# Altium schematic sheet 08-MagnetSensor.SchDoc: Magnet Sensor
size A2; DocumentNumber: 8; SheetNumber: 8; SheetTotal: 15
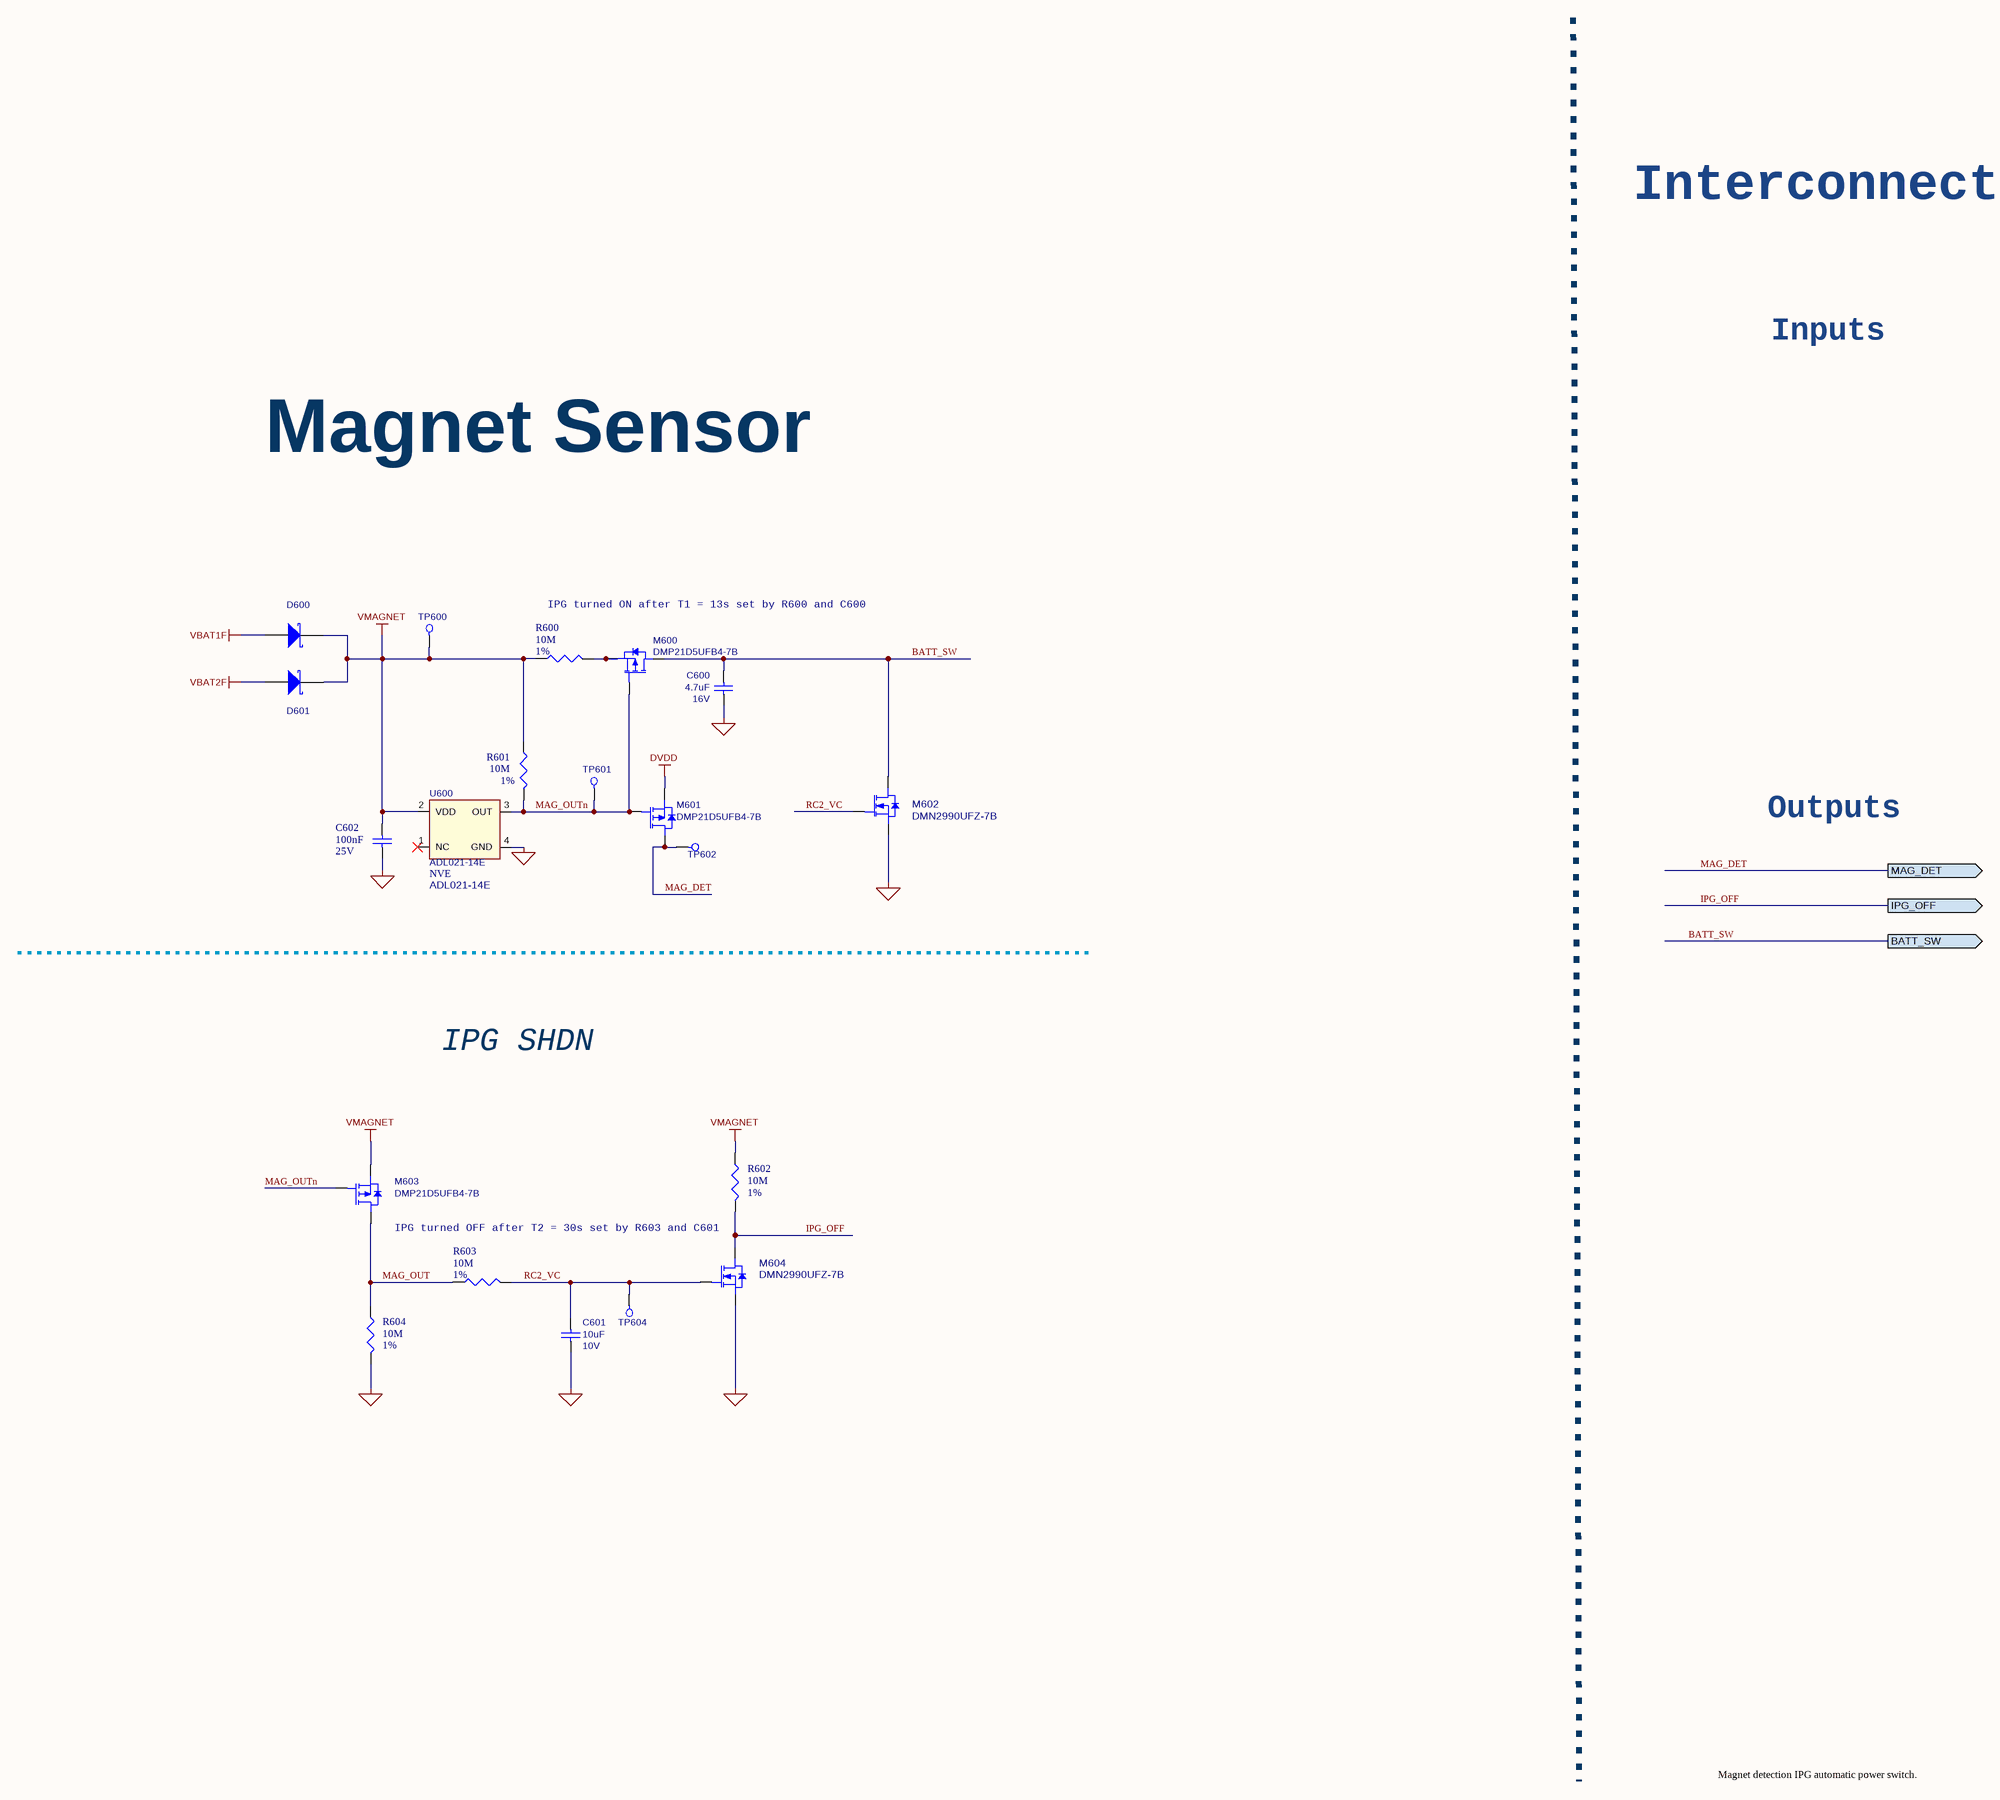
[diagram p0: 08-MagnetSensor.SchDoc]

## Parts
C600  value 4.7uF  Rating: 16V  [CAP0603_REDUCED]  (hidden comment: GRM188R61C475KE11)
C601  value 10uF  Rating: 10V  [CAP0402_REDUCED]  (hidden comment: ZRB15XR61A106ME01D)
C602  value 100nF  Rated DC Voltage (URdc): 25V  [C0201_C]  (hidden comment: GRM033R61E104KE14J)
D600  NSR0130P2T5G  [ONSC_SOD-923_CASE514AB]  (value not drawn)
D601  NSR0130P2T5G  [ONSC_SOD-923_CASE514AB]  (value not drawn)
M600  DMP21D5UFB4-7B  [DIODESINC_X2-DFN1006-3_REDUCED]
M601  DMP21D5UFB4-7B  [DIODESINC_X2-DFN1006-3_REDUCED]
M602  DMN2990UFZ-7B  [DIODESINC_X2-DFN0606-3]
M603  DMP21D5UFB4-7B  [DIODESINC_X2-DFN1006-3_REDUCED]
M604  DMN2990UFZ-7B  [DIODESINC_X2-DFN0606-3]
R600  value 10M  Tolerance: 1%  [R0201_C]  (hidden comment: CRCW020110M0FNED)
R601  value 10M  Tolerance: 1%  [R0201_C]  (hidden comment: CRCW020110M0FNED)
R602  value 10M  Tolerance: 1%  [R0201_C]  (hidden comment: CRCW020110M0FNED)
R603  value 10M  Tolerance: 1%  [R0201_C]  (hidden comment: CRCW020110M0FNED)
R604  value 10M  Tolerance: 1%  [R0201_C]  (hidden comment: CRCW020110M0FNED)
TP600  Test Point  [testpad_0.9mm]  (value not drawn)  (no BOM)
TP601  Test Point  [testpad_0.9mm]  (value not drawn)  (no BOM)
TP602  Test Point  [testpad_0.9mm]  (value not drawn)  (no BOM)
TP604  Test Point  [testpad_0.9mm]  (value not drawn)  (no BOM)
U600  ADL021-14E  Manufacturer: NVE  [NVE_ULLGA4]

## Ports
BATT_SW (out), IPG_OFF (out), MAG_DET (out)

## Nets
DVDD: M601.2(S)
GND: C600.2 C601.1 C602.1 M602.2(S) M604.2(S) R604.2 U600.4(GND)
VBAT1F: D600.2(A)
VBAT2F: D601.2(A)
VMAGNET: C602.2 D600.1(K) D601.1(K) M603.2(S) R600.1 R601.1 R602.1 TP600.1 U600.2(VDD)
BATT_SW: C600.1 M600.3(D) M602.3(D) ; port BATT_SW
IPG_OFF: M604.3(D) R602.2 ; port IPG_OFF
MAG_DET: M601.3(D) TP602.1 ; port MAG_DET
MAG_OUT: M603.3(D) R603.1 R604.1
MAG_OUTn: M600.1(G) M601.1(G) M603.1(G) R601.2 TP601.1 U600.3(OUT)
RC2_VC: C601.2 M602.1(G) M604.1(G) R603.2 TP604.1
NetM600_2: M600.2(S) R600.2

Not connected (* = marked no-connect by the designer): U600 1(NC)*

## Notes on the sheet
- Interconnect
- Inputs
- Magnet Sensor
- IPG turned ON after T1 = 13s set by R600 and C600
- Outputs
- IPG SHDN
- (near M603) IPG turned OFF after T2 = 30s set by R603 and C601
- Magnet detection IPG automatic power switch.
- Project:
- Schematic:
- Design by:
- Date:
- Ver:
- .
- Comments:
- Reviewed by:

## Library data of the parts
C600 = GRM188R61C475KE11: Capacitor, 4.7uF, X5R, 16V, 10%, 0603, Implant-grade; Manufacturer: Murata; Medical Grade MFR PN: GCH188R61C475KE11; Length (mm): 1.60 ±0.10; Medical Grade MFR: Murata; PCB Footprint: cap0603_reduced; Thickness (mm): 0.80 ±0.10; Width (mm): 0.80 ±0.10; Category: Capacitor; Package Description: 0603; Check: *; Supplier 1: Arrow Electronics; Supplier Part Number 1: GRM188R61C475KE11D; Status: *; Review: *; Manufacturer Part Number: GRM188R61C475KE11
C601 = ZRB15XR61A106ME01D: Capacitor, 10uf, X5R, 10V, 20%, 0402, Implant-grade; Manufacturer: Murata; Medical Grade MFR: TBD; Length (mm): 1.00 ±0.22; Medical Grade MFR PN: TBD; PCB Footprint: cap0402_reduced; Thickness (mm): 0.65 ±0.2; Width (mm): 0.50 ±0.2; Category: Capacitor; Package Description: 0402; Check: *; Status: *; Review: *; Supplier 1: Arrow Electronics; Supplier Part Number 1: ZRB15XR61A106ME01D; Manufacturer Part Number: ZRB15XR61A106ME01D
C602 = GRM033R61E104KE14J: Ceramic Capacitor, Multilayer, Ceramic, 25V, 10% +Tol, 10% -Tol, X5R, 15% TC, 0.1uF, Surface Mount, 0201; Manufacturer: Murata; Multilayer: Yes; Category: Ceramic Capacitors; Supplier: Digikey; Supplier Part Number: 490-14571-1-ND; Manufacturer Part Number: GRM033R61E104KE14J; RoHS: Yes; Stock: 1540851; Pricing: 1=0,1, 10=0,033, 50=0,0192, 100=0,0148, 500=0,01118, 1000=0,00878, 2500=0,00798, 5000=0,00734 (USD); Mounting Technology: Surface Mount; Pins: 2; Dielectric Material: Ceramic; Package Shape: Rectangular; Case/Package: 0201; Terminal Finish: Nickel; Min Operating Temperature: -55°C; Max Operating Temperature: 85°C; JESD-609 Code: e3; Capacitor Type: Ceramic; Tolerance  (fill in as +-): 10%; Package Style: SMTMeter; Packaging: Tape and Reel; Tolerance (fill in as +-): 10%; Temperature Characteristics Code: X5R; Termination: Wraparound; Length: 0.6mm; Width: 0.3mm; Height: 0.3mm; Reach SVHC Compliant: Yes; RoHS Compliant: Yes; ComponentLink1URL: https://psearch.en.murata.com:443/capacitor/product/GRM033R61E104KE14%23.pdf?src-supplier=IHS+Markit; ComponentLink1Description: https://psearch.en.murata.com:443/capacitor/product/GRM033R61E104KE14%23.pdf?src-supplier=IHS+Markit; ComponentLink2URL: http://www.mouser.com/ds/2/281/c02e-2905.pdf?src-supplier=Mouser; ComponentLink2Description: http://www.mouser.com/ds/2/281/c02e-2905.pdf?src-supplier=Mouser; ComponentLink3URL: http://search.murata.co.jp/Ceramy/image/img/A01X/G101/ENG/GRM033R61E104KE14-01.pdf?src-supplier=Digikey; ComponentLink3Description: http://search.murata.co.jp/Ceramy/image/img/A01X/G101/ENG/GRM033R61E104KE14-01.pdf?src-supplier=Digikey; ComponentLink4URL: https://search.murata.co.jp/Ceramy/image/img/A01X/G101/ENG/GRM033R61E104KE14-01.pdf?src-supplier=Digikey; ComponentLink4Description: https://search.murata.co.jp/Ceramy/image/img/A01X/G101/ENG/GRM033R61E104KE14-01.pdf?src-supplier=Digikey; Supplier 1: Arrow Electronics; Supplier Part Number 1: GRM033R61E104KE14J
D600 D601 = NSR0130P2T5G: Schottky, 30V, 100mA, 385mV, 200mW, SOD-923; Manufacturer: ON Semiconductor; Medical Grade MFR: TBD; Review: 020823; Length (mm): 1.00 ±0.05; Medical Grade MFR PN: TBD; PCB Footprint: TBD; Rating: 30V; Thickness (mm): 0.40 ±0.03; Value: NSR0130P2T5G; Width (mm): 0.60 ±0.05; Category: Diode; Supplier 1: Future Electronics; Supplier Part Number 1: 7098145; Status: Approved; Manufacturer Part Number: NSR0130P2T5G
M600 M601 M603 = DMP21D5UFB4-7B: MOSFET, P-chan, -20V, -400mA, X2-DFN1006-3; Manufacturer: Diodes Inc; Medical Grade MFR: TBD; Review: 020823; Category: Transistor; Length (mm): 1.00 ±0.05; Medical Grade MFR PN: TBD; Rating: -20V; Thickness (mm): 0.40; Width (mm): 0.60 ±0.05; Value: DMP21D5UFB4-7B; Supplier 1: Digi-Key; Supplier Part Number 1: DMP21D5UFB4-7BDICT-ND; Status: Approved; Manufacturer Part Number: DMP21D5UFB4-7B
M602 M604 = DMN2990UFZ-7B: MOSFET, N-Chan, 20V, 170mA, DFN0606; Manufacturer: Diodes Inc; Medical Grade MFR: TBD; Review: 020823; Category: Transistor; Length (mm): 0.62 ±0.05; Medical Grade MFR PN: TBD; PCB Footprint: TBD; Rating: 20V; Thickness (mm): 0.38 ±0.02; Value: DMN2990UFZ-7B; Width (mm): 0.62 ±0.05; Supplier 1: Digi-Key; Supplier Part Number 1: DMN2990UFZ-7BDICT-ND; Status: Approved; Manufacturer Part Number: DMN2990UFZ-7B
R600-R604 = CRCW020110M0FNED: Fixed Resistor, Metal Glaze/thick Film, 0.05W, 10000000ohm, 30V, 1% +/-Tol, 200ppm/Cel, Surface Mount, 0201; Manufacturer: Vishay Draloric; Medical Grade MFR: Mini-Systems; Medical Grade MFR PN: MWA96SM-1005F-NS62TR; Power: 50mW; Rated Temperature: 70°C; Temperature Coefficient: 200ppm/°C; Category: Chip SMD Resistors; Supplier: Mouser; Supplier Part Number: 71-CRCW020110M0FNED; Manufacturer Part Number: CRCW020110M0FNED; RoHS: Yes; Stock: 159754; Pricing: 1=0,1, 10=0,024, 50=0,024, 100=0,014, 1000=0,011, 10000=0,006 (USD); Mounting Technology: Surface Mount; Pins: 2; Package Shape: Rectangular; Case/Package: 0201; Terminal Finish: Nickel; Min Operating Temperature: -55°C; Max Operating Temperature: 155°C; JESD-609 Code: e3; Resistor Type: FIXED RESISTOR; Packaging: Tape and Reel; Technology: METAL GLAZE/THICK FILM; Termination: Wraparound; Working Voltage: 30V; Reach SVHC Compliant: Yes; RoHS Compliant: Yes; ComponentLink1URL: https://datasheet.ciiva.com:443/pdfs/VipMasterIC/IC/VISH/VISH-S-A0002932828/VISH-S-A0002932828-1.pdf?src-supplier=IHS+Markit; ComponentLink1Description: https://datasheet.ciiva.com:443/pdfs/VipMasterIC/IC/VISH/VISH-S-A0002932828/VISH-S-A0002932828-1.pdf?src-supplier=IHS+Markit; ComponentLink2URL: https://datasheet.ciiva.com/7673/1719906-7673177.pdf?src-supplier=Element14; ComponentLink2Description: https://datasheet.ciiva.com/7673/1719906-7673177.pdf?src-supplier=Element14; ComponentLink3URL: https://datasheet.ciiva.com/7673/1719906-7673178.pdf?src-supplier=Element14; ComponentLink3Description: https://datasheet.ciiva.com/7673/1719906-7673178.pdf?src-supplier=Element14; ComponentLink4URL: https://datasheet.ciiva.com/22692/1719906-22692711.pdf?src-supplier=Element14; ComponentLink4Description: https://datasheet.ciiva.com/22692/1719906-22692711.pdf?src-supplier=Element14; ComponentLink5URL: https://datasheet.ciiva.com/22665/1700795-22665701.pdf?src-supplier=Element14; ComponentLink5Description: https://datasheet.ciiva.com/22665/1700795-22665701.pdf?src-supplier=Element14; Supplier 1: Digikey; Supplier Part Number 1: 541-CRCW020110M0FNEDCT-ND
TP600-TP602 TP604 = Test Point: Test pad, 0.90mm circular pad; PCB Footprint: testpad_0p90mm; Length (mm): 0.90; Manufacturer: N/A; Manufacturer PN: N/A; Medical Grade MFR: N/A; Medical Grade MFR PN: N/A; Rating: N/A; Thickness (mm): N/A; Value: Test point; Width (mm): 0.90; Category: Test point; Status: *; Review: *
U600 = ADL021-14E: Magnet Sensor, 15 Gauss, ULLGA4, Implant-grade; Medical Grade MFR PN: BD020-14E; PCB Footprint: TBD; Length (mm): 1.10; Medical Grade MFR: NVE; Rating: N/A; Thickness (mm): 0.40; Value: ADL021-14E; Width (mm): 1.10; Category: IC; Package Description: TBD; Supplier 1: Digi-Key; Supplier Part Number 1: 391-ADL021-14ECT-ND; Status: *; Review: *; Manufacturer Part Number: ADL021-14E